# Altium schematic sheet iso_lvds_tx.SchDoc: Tx iso drivers
size A2; Author: Cassio Berni; DrawnBy: CCB; Revision: 1_01; SheetNumber: 1; SheetTotal: 4; PageSetup: Record=PageOptions|CenterHorizontal=True|CenterVertical=True|PrintScale=0.50|XCorrection=1.00|YCorrection=1.00|PrintKind=0|BorderSize=5000000|LeftOffset=0|BottomOffset=0|Orientation=2|PaperLength=1000|PaperWidth=1000|Scale=100|PaperSource=7|PrintQuality=-3|MediaType=1|DitherType=10|PrintScaleMode=1|PaperKind=A4|PaperIndex=9
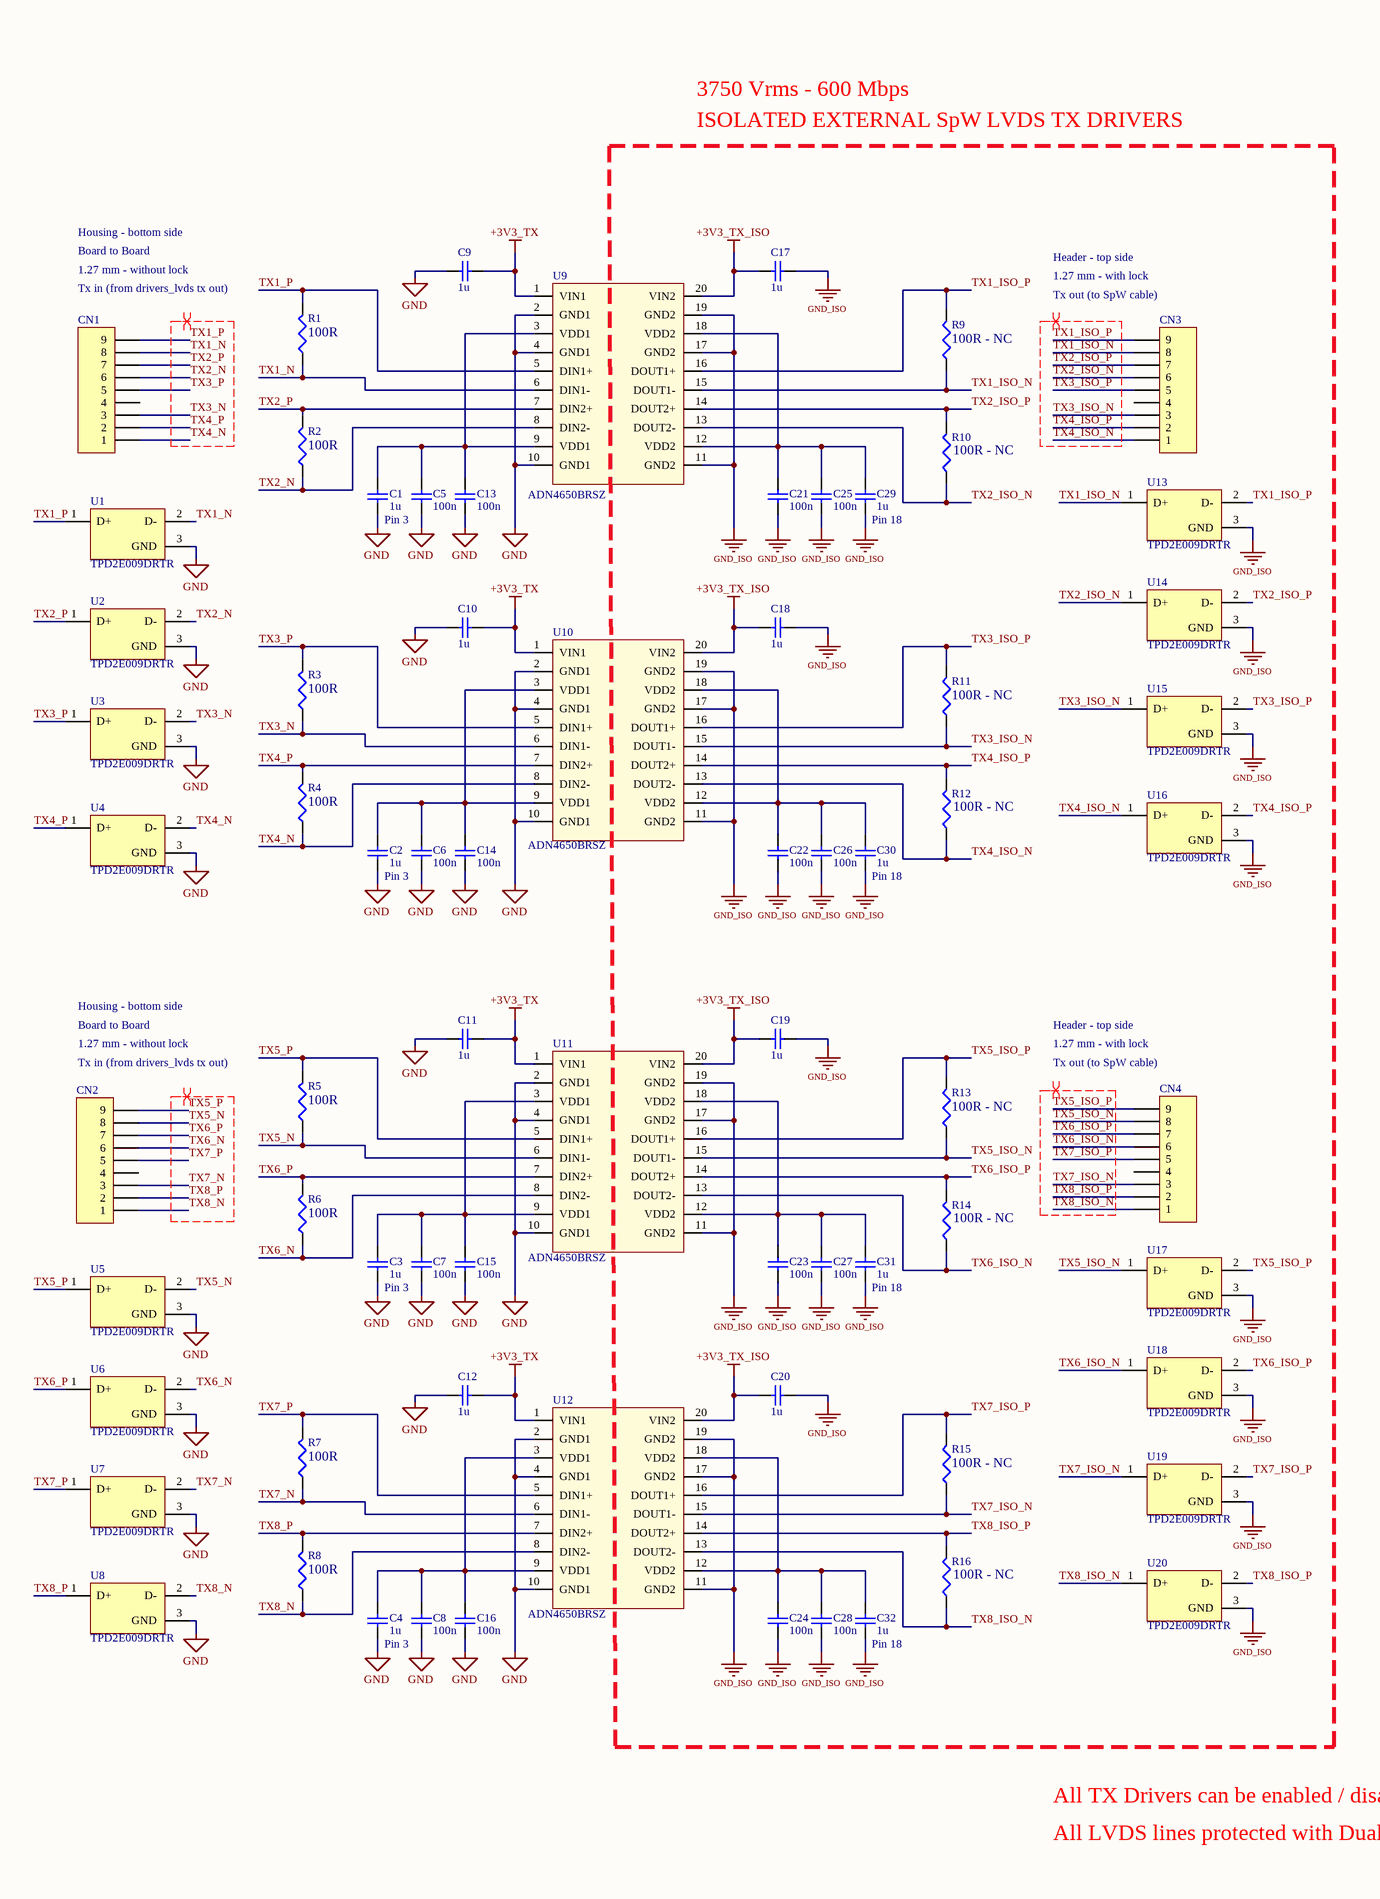
[diagram p0: iso_lvds_tx.SchDoc, left]
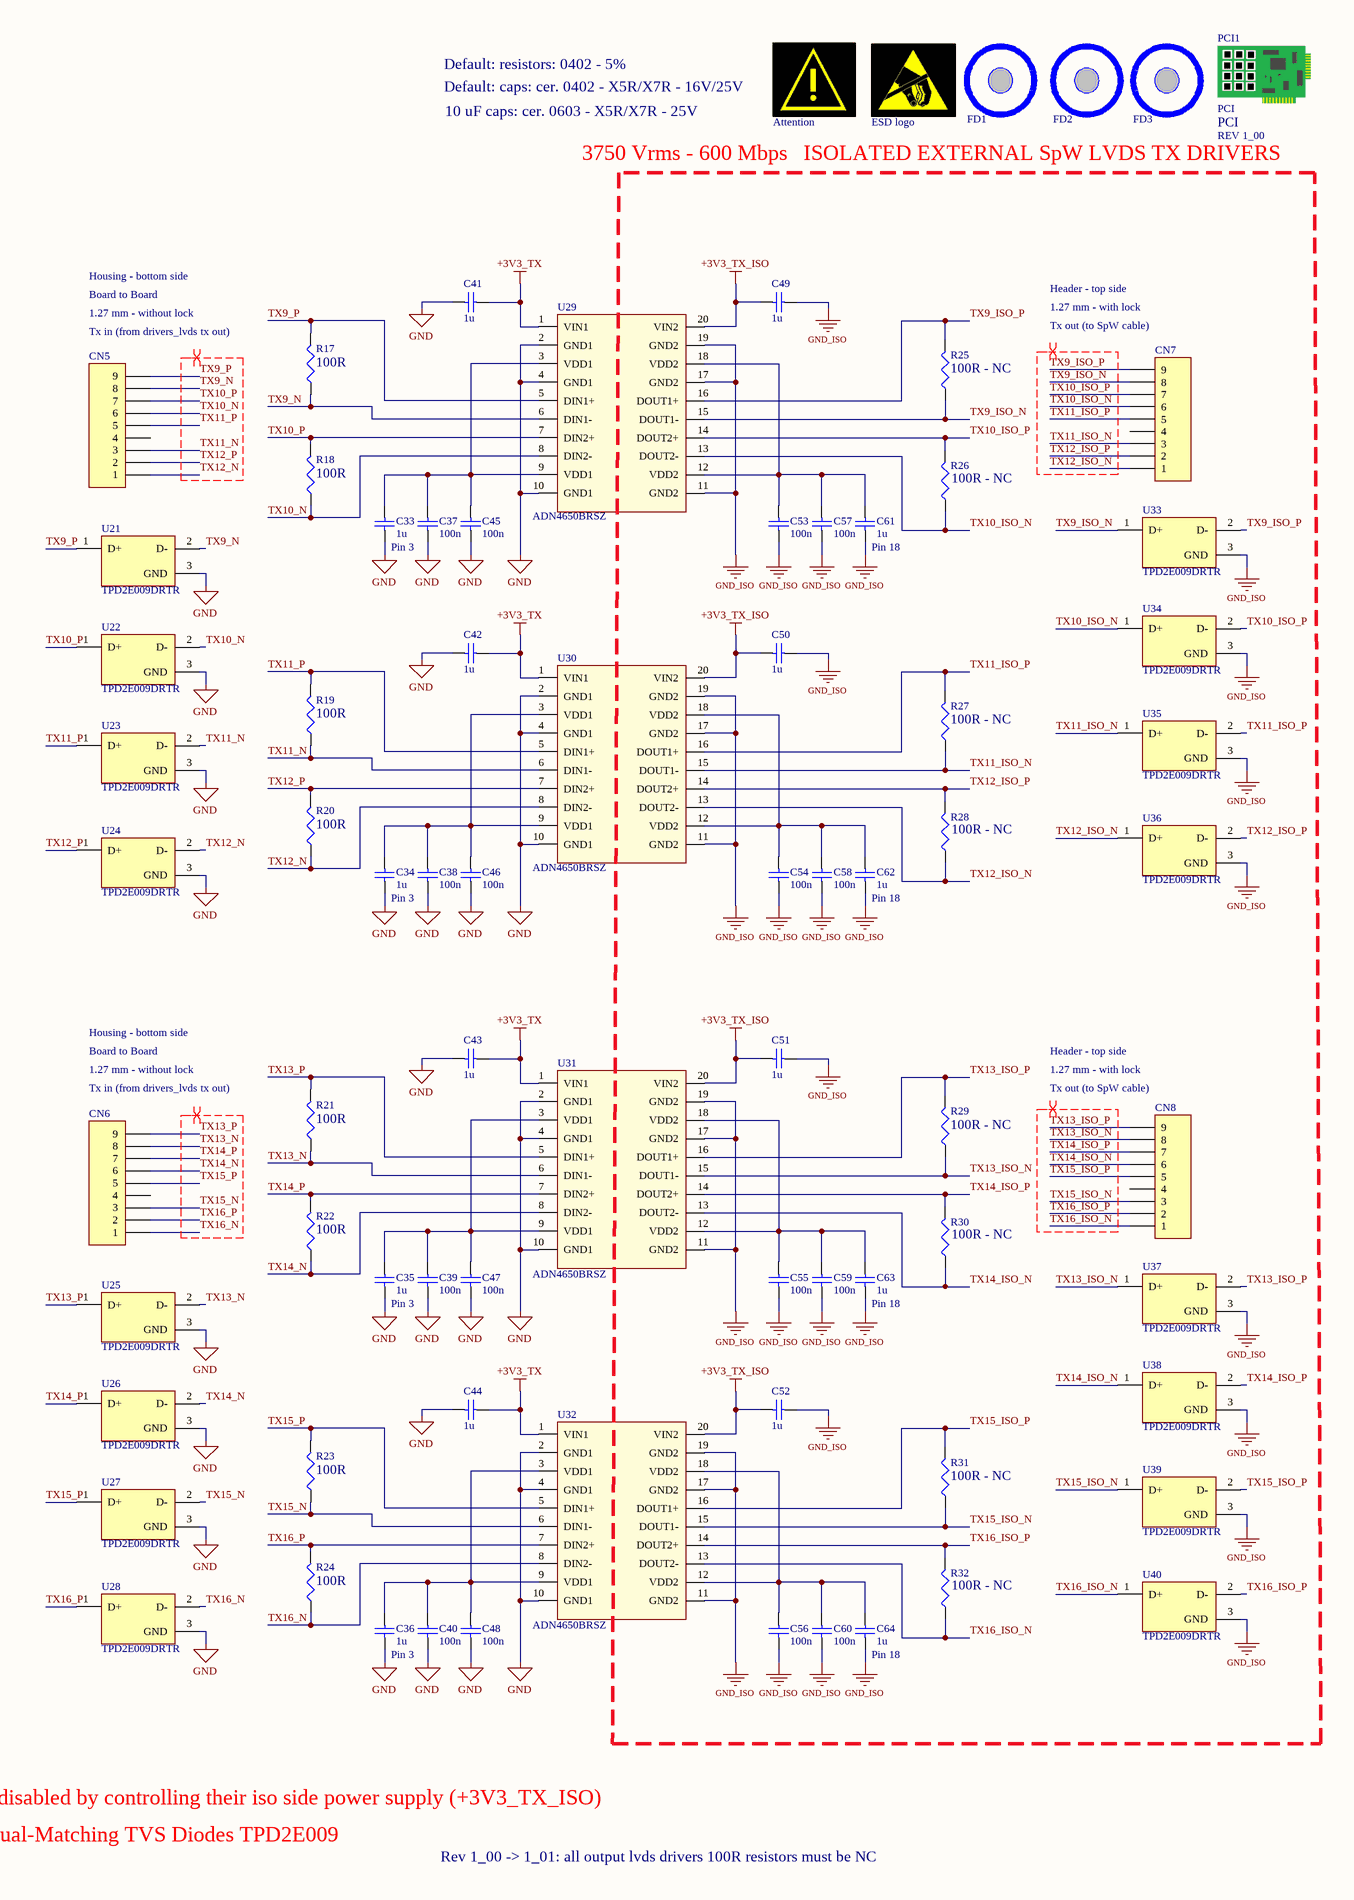
[diagram p1: iso_lvds_tx.SchDoc, right]

## Parts
AT1  Valor: Attention  [LEIA_DOCUMENTACAO]  (hidden comment: ##nl)
C1  Valor: 1u  [0402-cap]  (hidden comment: Capacitor Cerâmico SMD)
C2  Valor: 1u  [0402-cap]  (hidden comment: Capacitor Cerâmico SMD)
C3  Valor: 1u  [0402-cap]  (hidden comment: Capacitor Cerâmico SMD)
C4  Valor: 1u  [0402-cap]  (hidden comment: Capacitor Cerâmico SMD)
C5  Valor: 100n  [0402-cap]  (hidden comment: Capacitor Cerâmico SMD)
C6  Valor: 100n  [0402-cap]  (hidden comment: Capacitor Cerâmico SMD)
C7  Valor: 100n  [0402-cap]  (hidden comment: Capacitor Cerâmico SMD)
C8  Valor: 100n  [0402-cap]  (hidden comment: Capacitor Cerâmico SMD)
C9  Valor: 1u  [0402-cap]  (hidden comment: Capacitor Cerâmico SMD)
C10  Valor: 1u  [0402-cap]  (hidden comment: Capacitor Cerâmico SMD)
C11  Valor: 1u  [0402-cap]  (hidden comment: Capacitor Cerâmico SMD)
C12  Valor: 1u  [0402-cap]  (hidden comment: Capacitor Cerâmico SMD)
C13  Valor: 100n  [0402-cap]  (hidden comment: Capacitor Cerâmico SMD)
C14  Valor: 100n  [0402-cap]  (hidden comment: Capacitor Cerâmico SMD)
C15  Valor: 100n  [0402-cap]  (hidden comment: Capacitor Cerâmico SMD)
C16  Valor: 100n  [0402-cap]  (hidden comment: Capacitor Cerâmico SMD)
C17  Valor: 1u  [0402-cap]  (hidden comment: Capacitor Cerâmico SMD)
C18  Valor: 1u  [0402-cap]  (hidden comment: Capacitor Cerâmico SMD)
C19  Valor: 1u  [0402-cap]  (hidden comment: Capacitor Cerâmico SMD)
C20  Valor: 1u  [0402-cap]  (hidden comment: Capacitor Cerâmico SMD)
C21  Valor: 100n  [0402-cap]  (hidden comment: Capacitor Cerâmico SMD)
C22  Valor: 100n  [0402-cap]  (hidden comment: Capacitor Cerâmico SMD)
C23  Valor: 100n  [0402-cap]  (hidden comment: Capacitor Cerâmico SMD)
C24  Valor: 100n  [0402-cap]  (hidden comment: Capacitor Cerâmico SMD)
C25  Valor: 100n  [0402-cap]  (hidden comment: Capacitor Cerâmico SMD)
C26  Valor: 100n  [0402-cap]  (hidden comment: Capacitor Cerâmico SMD)
C27  Valor: 100n  [0402-cap]  (hidden comment: Capacitor Cerâmico SMD)
C28  Valor: 100n  [0402-cap]  (hidden comment: Capacitor Cerâmico SMD)
C29  Valor: 1u  [0402-cap]  (hidden comment: Capacitor Cerâmico SMD)
C30  Valor: 1u  [0402-cap]  (hidden comment: Capacitor Cerâmico SMD)
C31  Valor: 1u  [0402-cap]  (hidden comment: Capacitor Cerâmico SMD)
C32  Valor: 1u  [0402-cap]  (hidden comment: Capacitor Cerâmico SMD)
C33  Valor: 1u  [0402-cap]  (hidden comment: Capacitor Cerâmico SMD)
C34  Valor: 1u  [0402-cap]  (hidden comment: Capacitor Cerâmico SMD)
C35  Valor: 1u  [0402-cap]  (hidden comment: Capacitor Cerâmico SMD)
C36  Valor: 1u  [0402-cap]  (hidden comment: Capacitor Cerâmico SMD)
C37  Valor: 100n  [0402-cap]  (hidden comment: Capacitor Cerâmico SMD)
C38  Valor: 100n  [0402-cap]  (hidden comment: Capacitor Cerâmico SMD)
C39  Valor: 100n  [0402-cap]  (hidden comment: Capacitor Cerâmico SMD)
C40  Valor: 100n  [0402-cap]  (hidden comment: Capacitor Cerâmico SMD)
C41  Valor: 1u  [0402-cap]  (hidden comment: Capacitor Cerâmico SMD)
C42  Valor: 1u  [0402-cap]  (hidden comment: Capacitor Cerâmico SMD)
C43  Valor: 1u  [0402-cap]  (hidden comment: Capacitor Cerâmico SMD)
C44  Valor: 1u  [0402-cap]  (hidden comment: Capacitor Cerâmico SMD)
C45  Valor: 100n  [0402-cap]  (hidden comment: Capacitor Cerâmico SMD)
C46  Valor: 100n  [0402-cap]  (hidden comment: Capacitor Cerâmico SMD)
C47  Valor: 100n  [0402-cap]  (hidden comment: Capacitor Cerâmico SMD)
C48  Valor: 100n  [0402-cap]  (hidden comment: Capacitor Cerâmico SMD)
C49  Valor: 1u  [0402-cap]  (hidden comment: Capacitor Cerâmico SMD)
C50  Valor: 1u  [0402-cap]  (hidden comment: Capacitor Cerâmico SMD)
C51  Valor: 1u  [0402-cap]  (hidden comment: Capacitor Cerâmico SMD)
C52  Valor: 1u  [0402-cap]  (hidden comment: Capacitor Cerâmico SMD)
C53  Valor: 100n  [0402-cap]  (hidden comment: Capacitor Cerâmico SMD)
C54  Valor: 100n  [0402-cap]  (hidden comment: Capacitor Cerâmico SMD)
C55  Valor: 100n  [0402-cap]  (hidden comment: Capacitor Cerâmico SMD)
C56  Valor: 100n  [0402-cap]  (hidden comment: Capacitor Cerâmico SMD)
C57  Valor: 100n  [0402-cap]  (hidden comment: Capacitor Cerâmico SMD)
C58  Valor: 100n  [0402-cap]  (hidden comment: Capacitor Cerâmico SMD)
C59  Valor: 100n  [0402-cap]  (hidden comment: Capacitor Cerâmico SMD)
C60  Valor: 100n  [0402-cap]  (hidden comment: Capacitor Cerâmico SMD)
C61  Valor: 1u  [0402-cap]  (hidden comment: Capacitor Cerâmico SMD)
C62  Valor: 1u  [0402-cap]  (hidden comment: Capacitor Cerâmico SMD)
C63  Valor: 1u  [0402-cap]  (hidden comment: Capacitor Cerâmico SMD)
C64  Valor: 1u  [0402-cap]  (hidden comment: Capacitor Cerâmico SMD)
CN1  MHDR1X9  [MHDR1X9_Axonn]  (value not drawn)
CN2  MHDR1X9  [MHDR1X9_Axonn]  (value not drawn)
CN3  MHDR1X9  [MHDR1X9_Axonn]  (value not drawn)
CN4  MHDR1X9  [MHDR1X9_Axonn]  (value not drawn)
CN5  MHDR1X9  [MHDR1X9_Axonn]  (value not drawn)
CN6  MHDR1X9  [MHDR1X9_Axonn]  (value not drawn)
CN7  MHDR1X9  [MHDR1X9_Axonn]  (value not drawn)
CN8  MHDR1X9  [MHDR1X9_Axonn]  (value not drawn)
ESD1  Valor: ESD logo  [ESTATICA]  (hidden comment: ##nl)
FD1  ##nl  [FIDUCIAL]  (value not drawn)
FD2  ##nl  [FIDUCIAL]  (value not drawn)
FD3  ##nl  [FIDUCIAL]  (value not drawn)
PCI1  PCI  Rev: REV 1_00
R1  Valor: 100R  [0402-res]  (hidden comment: Res3)
R2  Valor: 100R  [0402-res]  (hidden comment: Res3)
R3  Valor: 100R  [0402-res]  (hidden comment: Res3)
R4  Valor: 100R  [0402-res]  (hidden comment: Res3)
R5  Valor: 100R  [0402-res]  (hidden comment: Res3)
R6  Valor: 100R  [0402-res]  (hidden comment: Res3)
R7  Valor: 100R  [0402-res]  (hidden comment: Res3)
R8  Valor: 100R  [0402-res]  (hidden comment: Res3)
R9  Valor: 100R - NC  [0402-res]  (hidden comment: Res3)
R10  Valor: 100R - NC  [0402-res]  (hidden comment: Res3)
R11  Valor: 100R - NC  [0402-res]  (hidden comment: Res3)
R12  Valor: 100R - NC  [0402-res]  (hidden comment: Res3)
R13  Valor: 100R - NC  [0402-res]  (hidden comment: Res3)
R14  Valor: 100R - NC  [0402-res]  (hidden comment: Res3)
R15  Valor: 100R - NC  [0402-res]  (hidden comment: Res3)
R16  Valor: 100R - NC  [0402-res]  (hidden comment: Res3)
R17  Valor: 100R  [0402-res]  (hidden comment: Res3)
R18  Valor: 100R  [0402-res]  (hidden comment: Res3)
R19  Valor: 100R  [0402-res]  (hidden comment: Res3)
R20  Valor: 100R  [0402-res]  (hidden comment: Res3)
R21  Valor: 100R  [0402-res]  (hidden comment: Res3)
R22  Valor: 100R  [0402-res]  (hidden comment: Res3)
R23  Valor: 100R  [0402-res]  (hidden comment: Res3)
R24  Valor: 100R  [0402-res]  (hidden comment: Res3)
R25  Valor: 100R - NC  [0402-res]  (hidden comment: Res3)
R26  Valor: 100R - NC  [0402-res]  (hidden comment: Res3)
R27  Valor: 100R - NC  [0402-res]  (hidden comment: Res3)
R28  Valor: 100R - NC  [0402-res]  (hidden comment: Res3)
R29  Valor: 100R - NC  [0402-res]  (hidden comment: Res3)
R30  Valor: 100R - NC  [0402-res]  (hidden comment: Res3)
R31  Valor: 100R - NC  [0402-res]  (hidden comment: Res3)
R32  Valor: 100R - NC  [0402-res]  (hidden comment: Res3)
U1  TPD2E009DRTR  [DRT3]
U2  TPD2E009DRTR  [DRT3]
U3  TPD2E009DRTR  [DRT3]
U4  TPD2E009DRTR  [DRT3]
U5  TPD2E009DRTR  [DRT3]
U6  TPD2E009DRTR  [DRT3]
U7  TPD2E009DRTR  [DRT3]
U8  TPD2E009DRTR  [DRT3]
U9  ADN4650BRSZ  [SSOP-RS-20]
U10  ADN4650BRSZ  [SSOP-RS-20]
U11  ADN4650BRSZ  [SSOP-RS-20]
U12  ADN4650BRSZ  [SSOP-RS-20]
U13  TPD2E009DRTR  [DRT3]
U14  TPD2E009DRTR  [DRT3]
U15  TPD2E009DRTR  [DRT3]
U16  TPD2E009DRTR  [DRT3]
U17  TPD2E009DRTR  [DRT3]
U18  TPD2E009DRTR  [DRT3]
U19  TPD2E009DRTR  [DRT3]
U20  TPD2E009DRTR  [DRT3]
U21  TPD2E009DRTR  [DRT3]
U22  TPD2E009DRTR  [DRT3]
U23  TPD2E009DRTR  [DRT3]
U24  TPD2E009DRTR  [DRT3]
U25  TPD2E009DRTR  [DRT3]
U26  TPD2E009DRTR  [DRT3]
U27  TPD2E009DRTR  [DRT3]
U28  TPD2E009DRTR  [DRT3]
U29  ADN4650BRSZ  [SSOP-RS-20]
U30  ADN4650BRSZ  [SSOP-RS-20]
U31  ADN4650BRSZ  [SSOP-RS-20]
U32  ADN4650BRSZ  [SSOP-RS-20]
U33  TPD2E009DRTR  [DRT3]
U34  TPD2E009DRTR  [DRT3]
U35  TPD2E009DRTR  [DRT3]
U36  TPD2E009DRTR  [DRT3]
U37  TPD2E009DRTR  [DRT3]
U38  TPD2E009DRTR  [DRT3]
U39  TPD2E009DRTR  [DRT3]
U40  TPD2E009DRTR  [DRT3]

## Blocks framed on the sheet
ISOLATED EXTERNAL SpW LVDS TX DRIVERS: C17-C32 CN3 CN4 R9-R16 U9-U20
ISOLATED EXTERNAL SpW LVDS TX DRIVERS: C49-C64 CN7 CN8 R25-R32 U29-U40

## Nets
+3V3_TX: C9.1 C10.1 C11.1 C12.1 C41.1 C42.1 C43.1 C44.1 U9.1(VIN1) U10.1(VIN1) U11.1(VIN1) U12.1(VIN1) U29.1(VIN1) U30.1(VIN1) U31.1(VIN1) U32.1(VIN1)
+3V3_TX_ISO: C17.2 C18.2 C19.2 C20.2 C49.2 C50.2 C51.2 C52.2 U9.20(VIN2) U10.20(VIN2) U11.20(VIN2) U12.20(VIN2) U29.20(VIN2) U30.20(VIN2) U31.20(VIN2) U32.20(VIN2)
GND: C1.1 C2.1 C3.1 C4.1 C5.1 C6.1 C7.1 C8.1 C9.2 C10.2 C11.2 C12.2 C13.1 C14.1 C15.1 C16.1 C33.1 C34.1 C35.1 C36.1 C37.1 C38.1 C39.1 C40.1 C41.2 C42.2 C43.2 C44.2 C45.1 C46.1 C47.1 C48.1 U1.3(GND) U2.3(GND) U3.3(GND) U4.3(GND) U5.3(GND) U6.3(GND) U7.3(GND) U8.3(GND) U9.2(GND1) U9.4(GND1) U9.10(GND1) U10.2(GND1) U10.4(GND1) U10.10(GND1) U11.2(GND1) U11.4(GND1) U11.10(GND1) U12.2(GND1) U12.4(GND1) U12.10(GND1) U21.3(GND) U22.3(GND) U23.3(GND) U24.3(GND) U25.3(GND) U26.3(GND) U27.3(GND) U28.3(GND) U29.2(GND1) U29.4(GND1) U29.10(GND1) U30.2(GND1) U30.4(GND1) U30.10(GND1) U31.2(GND1) U31.4(GND1) U31.10(GND1) U32.2(GND1) U32.4(GND1) U32.10(GND1)
GND_ISO: C17.1 C18.1 C19.1 C20.1 C21.1 C22.1 C23.1 C24.1 C25.1 C26.1 C27.1 C28.1 C29.1 C30.1 C31.1 C32.1 C49.1 C50.1 C51.1 C52.1 C53.1 C54.1 C55.1 C56.1 C57.1 C58.1 C59.1 C60.1 C61.1 C62.1 C63.1 C64.1 U9.11(GND2) U9.17(GND2) U9.19(GND2) U10.11(GND2) U10.17(GND2) U10.19(GND2) U11.11(GND2) U11.17(GND2) U11.19(GND2) U12.11(GND2) U12.17(GND2) U12.19(GND2) U13.3(GND) U14.3(GND) U15.3(GND) U16.3(GND) U17.3(GND) U18.3(GND) U19.3(GND) U20.3(GND) U29.11(GND2) U29.17(GND2) U29.19(GND2) U30.11(GND2) U30.17(GND2) U30.19(GND2) U31.11(GND2) U31.17(GND2) U31.19(GND2) U32.11(GND2) U32.17(GND2) U32.19(GND2) U33.3(GND) U34.3(GND) U35.3(GND) U36.3(GND) U37.3(GND) U38.3(GND) U39.3(GND) U40.3(GND)
TX1_ISO_N: CN3.8 R9.1 U9.15(DOUT1-) U13.1(D+)
TX1_ISO_P: CN3.9 R9.2 U9.16(DOUT1+) U13.2(D-)
TX1_N: CN1.8 R1.1 U1.2(D-) U9.6(DIN1-)
TX1_P: CN1.9 R1.2 U1.1(D+) U9.5(DIN1+)
TX2_ISO_N: CN3.6 R10.1 U9.13(DOUT2-) U14.1(D+)
TX2_ISO_P: CN3.7 R10.2 U9.14(DOUT2+) U14.2(D-)
TX2_N: CN1.6 R2.1 U2.2(D-) U9.8(DIN2-)
TX2_P: CN1.7 R2.2 U2.1(D+) U9.7(DIN2+)
TX3_ISO_N: CN3.3 R11.1 U10.15(DOUT1-) U15.1(D+)
TX3_ISO_P: CN3.5 R11.2 U10.16(DOUT1+) U15.2(D-)
TX3_N: CN1.3 R3.1 U3.2(D-) U10.6(DIN1-)
TX3_P: CN1.5 R3.2 U3.1(D+) U10.5(DIN1+)
TX4_ISO_N: CN3.1 R12.1 U10.13(DOUT2-) U16.1(D+)
TX4_ISO_P: CN3.2 R12.2 U10.14(DOUT2+) U16.2(D-)
TX4_N: CN1.1 R4.1 U4.2(D-) U10.8(DIN2-)
TX4_P: CN1.2 R4.2 U4.1(D+) U10.7(DIN2+)
TX5_ISO_N: CN4.8 R13.1 U11.15(DOUT1-) U17.1(D+)
TX5_ISO_P: CN4.9 R13.2 U11.16(DOUT1+) U17.2(D-)
TX5_N: CN2.8 R5.1 U5.2(D-) U11.6(DIN1-)
TX5_P: CN2.9 R5.2 U5.1(D+) U11.5(DIN1+)
TX6_ISO_N: CN4.6 R14.1 U11.13(DOUT2-) U18.1(D+)
TX6_ISO_P: CN4.7 R14.2 U11.14(DOUT2+) U18.2(D-)
TX6_N: CN2.6 R6.1 U6.2(D-) U11.8(DIN2-)
TX6_P: CN2.7 R6.2 U6.1(D+) U11.7(DIN2+)
TX7_ISO_N: CN4.3 R15.1 U12.15(DOUT1-) U19.1(D+)
TX7_ISO_P: CN4.5 R15.2 U12.16(DOUT1+) U19.2(D-)
TX7_N: CN2.3 R7.1 U7.2(D-) U12.6(DIN1-)
TX7_P: CN2.5 R7.2 U7.1(D+) U12.5(DIN1+)
TX8_ISO_N: CN4.1 R16.1 U12.13(DOUT2-) U20.1(D+)
TX8_ISO_P: CN4.2 R16.2 U12.14(DOUT2+) U20.2(D-)
TX8_N: CN2.1 R8.1 U8.2(D-) U12.8(DIN2-)
TX8_P: CN2.2 R8.2 U8.1(D+) U12.7(DIN2+)
TX9_ISO_N: CN7.8 R25.1 U29.15(DOUT1-) U33.1(D+)
TX9_ISO_P: CN7.9 R25.2 U29.16(DOUT1+) U33.2(D-)
TX9_N: CN5.8 R17.1 U21.2(D-) U29.6(DIN1-)
TX9_P: CN5.9 R17.2 U21.1(D+) U29.5(DIN1+)
TX10_ISO_N: CN7.6 R26.1 U29.13(DOUT2-) U34.1(D+)
TX10_ISO_P: CN7.7 R26.2 U29.14(DOUT2+) U34.2(D-)
TX10_N: CN5.6 R18.1 U22.2(D-) U29.8(DIN2-)
TX10_P: CN5.7 R18.2 U22.1(D+) U29.7(DIN2+)
TX11_ISO_N: CN7.3 R27.1 U30.15(DOUT1-) U35.1(D+)
TX11_ISO_P: CN7.5 R27.2 U30.16(DOUT1+) U35.2(D-)
TX11_N: CN5.3 R19.1 U23.2(D-) U30.6(DIN1-)
TX11_P: CN5.5 R19.2 U23.1(D+) U30.5(DIN1+)
TX12_ISO_N: CN7.1 R28.1 U30.13(DOUT2-) U36.1(D+)
TX12_ISO_P: CN7.2 R28.2 U30.14(DOUT2+) U36.2(D-)
TX12_N: CN5.1 R20.1 U24.2(D-) U30.8(DIN2-)
TX12_P: CN5.2 R20.2 U24.1(D+) U30.7(DIN2+)
TX13_ISO_N: CN8.8 R29.1 U31.15(DOUT1-) U37.1(D+)
TX13_ISO_P: CN8.9 R29.2 U31.16(DOUT1+) U37.2(D-)
TX13_N: CN6.8 R21.1 U25.2(D-) U31.6(DIN1-)
TX13_P: CN6.9 R21.2 U25.1(D+) U31.5(DIN1+)
TX14_ISO_N: CN8.6 R30.1 U31.13(DOUT2-) U38.1(D+)
TX14_ISO_P: CN8.7 R30.2 U31.14(DOUT2+) U38.2(D-)
TX14_N: CN6.6 R22.1 U26.2(D-) U31.8(DIN2-)
TX14_P: CN6.7 R22.2 U26.1(D+) U31.7(DIN2+)
TX15_ISO_N: CN8.3 R31.1 U32.15(DOUT1-) U39.1(D+)
TX15_ISO_P: CN8.5 R31.2 U32.16(DOUT1+) U39.2(D-)
TX15_N: CN6.3 R23.1 U27.2(D-) U32.6(DIN1-)
TX15_P: CN6.5 R23.2 U27.1(D+) U32.5(DIN1+)
TX16_ISO_N: CN8.1 R32.1 U32.13(DOUT2-) U40.1(D+)
TX16_ISO_P: CN8.2 R32.2 U32.14(DOUT2+) U40.2(D-)
TX16_N: CN6.1 R24.1 U28.2(D-) U32.8(DIN2-)
TX16_P: CN6.2 R24.2 U28.1(D+) U32.7(DIN2+)
NetC1_2: C1.2 C5.2 C13.2 U9.3(VDD1) U9.9(VDD1)
NetC2_2: C2.2 C6.2 C14.2 U10.3(VDD1) U10.9(VDD1)
NetC3_2: C3.2 C7.2 C15.2 U11.3(VDD1) U11.9(VDD1)
NetC4_2: C4.2 C8.2 C16.2 U12.3(VDD1) U12.9(VDD1)
NetC21_2: C21.2 C25.2 C29.2 U9.12(VDD2) U9.18(VDD2)
NetC22_2: C22.2 C26.2 C30.2 U10.12(VDD2) U10.18(VDD2)
NetC23_2: C23.2 C27.2 C31.2 U11.12(VDD2) U11.18(VDD2)
NetC24_2: C24.2 C28.2 C32.2 U12.12(VDD2) U12.18(VDD2)
NetC33_2: C33.2 C37.2 C45.2 U29.3(VDD1) U29.9(VDD1)
NetC34_2: C34.2 C38.2 C46.2 U30.3(VDD1) U30.9(VDD1)
NetC35_2: C35.2 C39.2 C47.2 U31.3(VDD1) U31.9(VDD1)
NetC36_2: C36.2 C40.2 C48.2 U32.3(VDD1) U32.9(VDD1)
NetC53_2: C53.2 C57.2 C61.2 U29.12(VDD2) U29.18(VDD2)
NetC54_2: C54.2 C58.2 C62.2 U30.12(VDD2) U30.18(VDD2)
NetC55_2: C55.2 C59.2 C63.2 U31.12(VDD2) U31.18(VDD2)
NetC56_2: C56.2 C60.2 C64.2 U32.12(VDD2) U32.18(VDD2)

Not connected (* = marked no-connect by the designer): CN1 4; CN2 4; CN3 4; CN4 4; CN5 4; CN6 4; CN7 4; CN8 4

## Layout directives
differential pair; net class TX1_TX4; rule Differential Pairs Routing [Pref Gap = 10mil    Min Gap  = 10mil    Max Gap  = 10milPref Width = 10mil    Min Width  = 10mil    Max Width  = 10mil]: TX1_N, TX1_P, TX2_N, TX2_P, TX3_N, TX3_P, TX4_N, TX4_P
differential pair; net class TX5_TX8; rule Differential Pairs Routing [Pref Gap = 10mil    Min Gap  = 10mil    Max Gap  = 10milPref Width = 10mil    Min Width  = 10mil    Max Width  = 10mil]: TX5_N, TX5_P, TX6_N, TX6_P, TX7_N, TX7_P, TX8_N, TX8_P
differential pair; net class TX1_TX4_ISO; rule Differential Pairs Routing [Pref Gap = 10mil    Min Gap  = 10mil    Max Gap  = 10milPref Width = 10mil    Min Width  = 10mil    Max Width  = 10mil]: TX1_ISO_N, TX1_ISO_P, TX2_ISO_N, TX2_ISO_P, TX3_ISO_N, TX3_ISO_P, TX4_ISO_N, TX4_ISO_P
differential pair; net class TX5_TX8_ISO; rule Differential Pairs Routing [Pref Gap = 10mil    Min Gap  = 10mil    Max Gap  = 10milPref Width = 10mil    Min Width  = 10mil    Max Width  = 10mil]: TX5_ISO_N, TX5_ISO_P, TX6_ISO_N, TX6_ISO_P, TX7_ISO_N, TX7_ISO_P, TX8_ISO_N, TX8_ISO_P
differential pair; net class TX9_TX12; rule Differential Pairs Routing [Pref Gap = 10mil    Min Gap  = 10mil    Max Gap  = 10milPref Width = 10mil    Min Width  = 10mil    Max Width  = 10mil]: TX9_N, TX9_P, TX10_N, TX10_P, TX11_N, TX11_P, TX12_N, TX12_P
differential pair; net class TX13_TX16; rule Differential Pairs Routing [Pref Gap = 10mil    Min Gap  = 10mil    Max Gap  = 10milPref Width = 10mil    Min Width  = 10mil    Max Width  = 10mil]: TX13_ISO_N, TX13_ISO_P, TX13_N, TX13_P, TX14_ISO_N, TX14_ISO_P, TX14_N, TX14_P, TX15_ISO_N, TX15_ISO_P, TX15_N, TX15_P, TX16_ISO_N, TX16_ISO_P, TX16_N, TX16_P
differential pair; net class TX9_TX12_ISO; rule Differential Pairs Routing [Pref Gap = 10mil    Min Gap  = 10mil    Max Gap  = 10milPref Width = 10mil    Min Width  = 10mil    Max Width  = 10mil]: TX9_ISO_N, TX9_ISO_P, TX10_ISO_N, TX10_ISO_P, TX11_ISO_N, TX11_ISO_P, TX12_ISO_N, TX12_ISO_P

## Notes on the sheet
- Default: resistors: 0402 - 5%
- (near AT1) Default: caps: cer. 0402 - X5R/X7R - 16V/25V
- 3750 Vrms - 600 Mbps
- 10 uF caps: cer. 0603 - X5R/X7R - 25V
- Housing - bottom side
- Board to Board
- 1.27 mm - without lock
- Tx in (from drivers_lvds tx out)
- Header - top side
- 1.27 mm - with lock
- (near CN3) Tx out (to SpW cable)
- (near CN7) Tx out (to SpW cable)
- Pin 3
- (near C29) Pin 18
- (near C61) Pin 18
- (near C30) Pin 18
- (near C62) Pin 18
- (near CN4) Tx out (to SpW cable)
- (near CN8) Tx out (to SpW cable)
- (near C31) Pin 18
- (near C63) Pin 18
- (near C32) Pin 18
- (near C64) Pin 18
- All TX Drivers can be enabled / disabled by controlling their iso side power supply (+3V3_TX_ISO)
- All LVDS lines protected with Dual-Matching TVS Diodes TPD2E009
- Rev 1_00 -> 1_01: all output lvds drivers 100R resistors must be NC

## Library data of the parts
AT1 = ATENCAO
CN1-CN8 = MHDR1X9: Header, 9-Pin; LatestRevisionDate: 17-Jul-2002; LatestRevisionNote: Re-released for DXP Platform.; Publisher: Altium Limited
ESD1 = ESD
FD1-FD3 = Fiducial: Valor: *
R1-R32 = Res3: Resistor; Grupo: 01
U1-U8 U13-U28 U33-U40 = TPD2E009DRTR: ESD Protection Array for High-Speed Data Interfaces, 2 Channels, -40 to +85 degC, 3-pin SOT (DRT), Green (RoHS & no Sb/Br); Manufacturer: Texas Instruments; Breakdown Voltage(Min)(V): 9; Differential Capacitance(pF): 0.01; IEC 61000-4-2 Air-Gap(+/- kV): 8; IO Capacitance(Typ)(pF): 0.7; IO Leakage Current(nA): 10; Serial ATA / eSATA: TRUE; SubFamily: ESD Solution; DatasheetVersion: SLVS953A; PackageVersion: revD, Jun-2008; PackageReference: DRT3; PackageDescription: 3-Flat Lead Plastic Small Outline, 1 x 1 mm (inc leads), 0.35 mm Pitch; Supplier 1: Digi-Key; Supplier Part Number 1: 296-25410-2-ND; Supplier 2: Digi-Key; Supplier Part Number 2: 296-25410-1-ND; Supplier 3: Digi-Key; Supplier Part Number 3: 296-25410-6-ND; Supplier 4: Newark; Supplier Part Number 4: 50R8093; Supplier 5: Mouser; Supplier Part Number 5: 595-TPD2E009DRTR; Eco-Plan: Green (RoHS & no Sb/Br); IEC 61000-4-2 Contact(+/- kV): 8; Mounting Technology: Surface Mount; PartNumber: TPD2E009DRTR; ComponentLink1Description: Datasheet; ComponentLink1URL: http://www.ti.com/general/docs/lit/getliterature.tsp?genericPartNumber=TPD2E009&fileType=pdf; ComponentLink2Description: URL Link1; ComponentLink2URL: SamplesURL:http://www.ti.com/product/tpd2e009#samples
U9-U12 U29-U32 = ADN4650BRSZ: 5 kV RMS/3.75 kV RMS, 600 Mbps,  Dual-Channel LVDS Isolators; Fabricante: Analog Devices; Grupo: 07; Encapsulamento: SSOP-20; Valor: *; Obs: *; Datasheet: *; Part Number: ADN4650BRSZ
PCI1 = PCI: Valor: PCI